# EAGLE design FeatherAzureSphereLongTall (EAGLE 8.0.2)
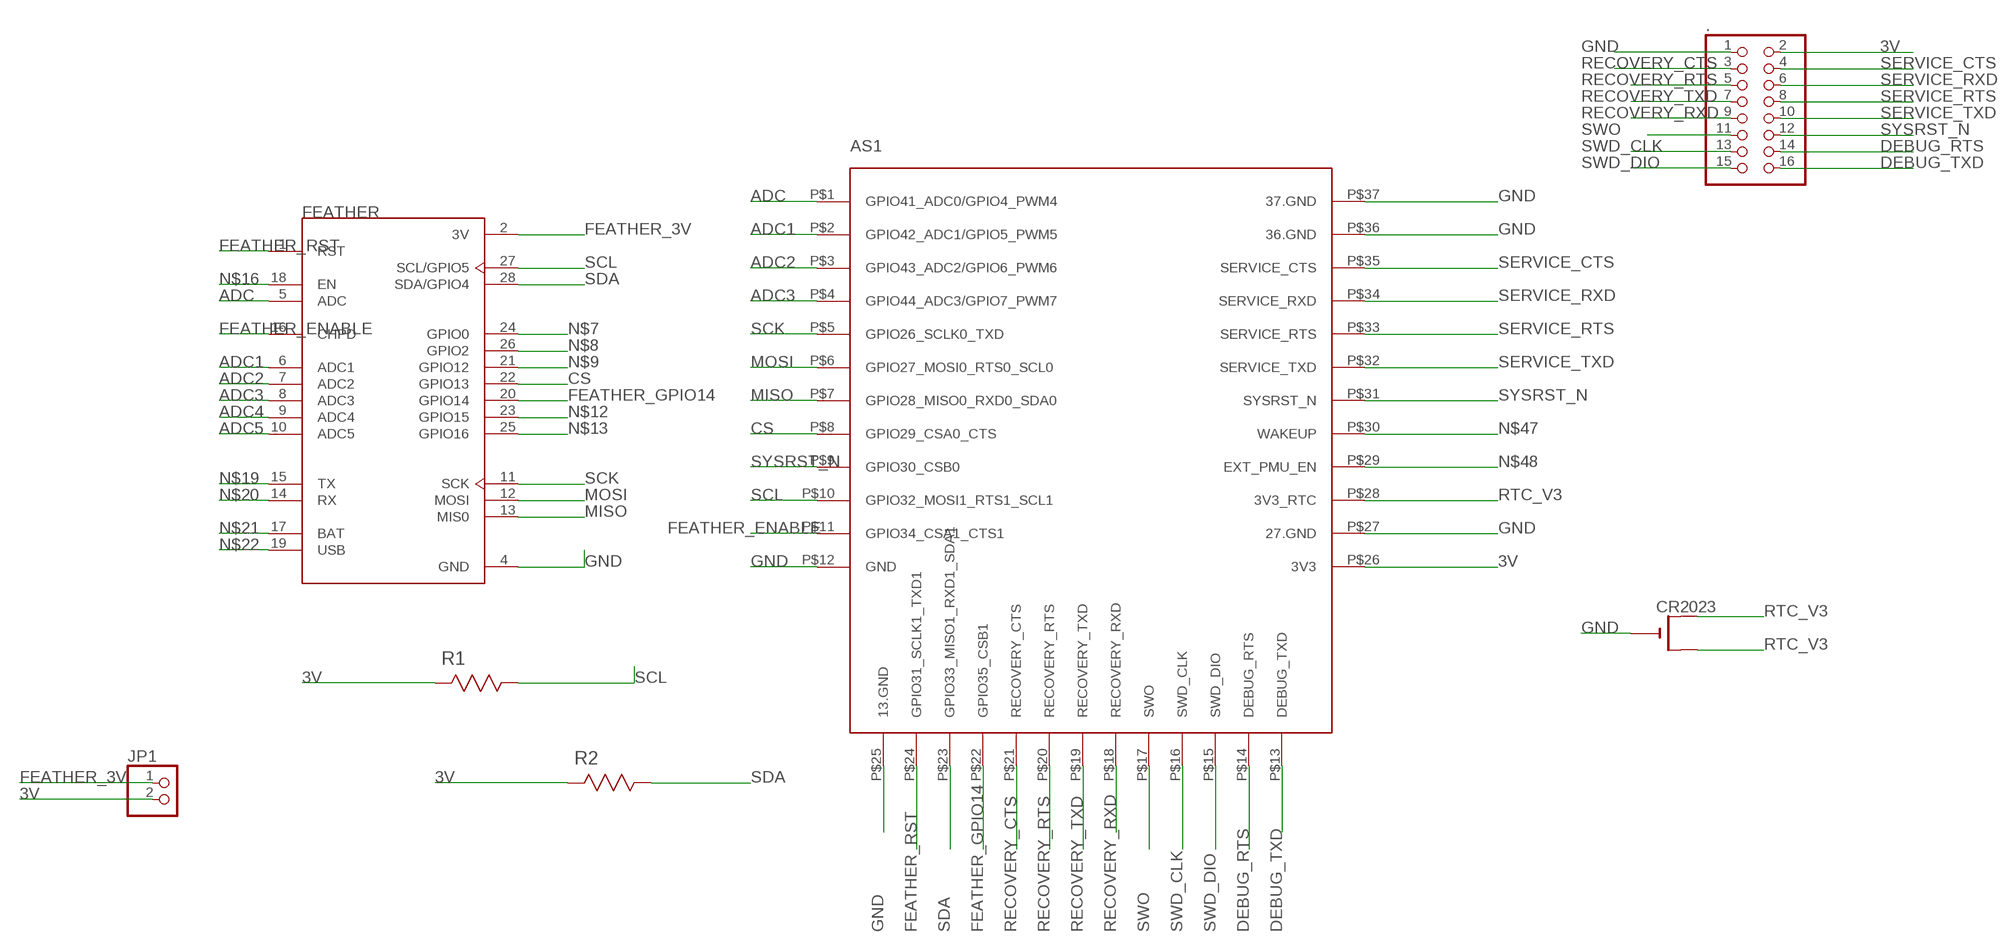
[diagram p0: schematic, sheet 1]

## Parts
.  PINHD-2X8  [2X08]
AS1  WF-M620-RSC1  [WF-M620-RSC1]
CR2023  CR2032SMT  [CR2032-SMD]
FEATHER  2821  [XCVR_2821]
JP1  PINHD-1X2  [1X02]
R1  ERJ-8RQF1R5V  [RESC3216X71N]
R2  ERJ-8RQF1R5V  [RESC3216X71N]

## Nets
3V: ..2 AS1.P$26(3V3) JP1.2 R1.2(R2) R2.2(R2)
ADC: AS1.P$1(GPIO41_ADC0/GPIO4_PWM4) FEATHER.5(ADC)
ADC1: AS1.P$2(GPIO42_ADC1/GPIO5_PWM5) FEATHER.6(ADC1)
ADC2: AS1.P$3(GPIO43_ADC2/GPIO6_PWM6) FEATHER.7(ADC2)
ADC3: AS1.P$4(GPIO44_ADC3/GPIO7_PWM7) FEATHER.8(ADC3)
ADC4: FEATHER.9(ADC4)
ADC5: FEATHER.10(ADC5)
CS: AS1.P$8(GPIO29_CSA0_CTS) FEATHER.22(GPIO13)
DEBUG_RTS: ..14 AS1.P$14(DEBUG_RTS)
DEBUG_TXD: ..16 AS1.P$13(DEBUG_TXD)
FEATHER_3V: FEATHER.2(3V) JP1.1
FEATHER_ENABLE: AS1.P$11(GPIO34_CSA1_CTS1) FEATHER.16(CHPD)
FEATHER_GPIO14: AS1.P$22(GPIO35_CSB1) FEATHER.20(GPIO14)
FEATHER_RST: AS1.P$24(GPIO31_SCLK1_TXD1) FEATHER.1(RST)
GND: ..1 AS1.P$12(GND) AS1.P$25(13.GND) AS1.P$27(27.GND) AS1.P$36(36.GND) AS1.P$37(37.GND) CR2023.- FEATHER.4(GND)
MISO: AS1.P$7(GPIO28_MISO0_RXD0_SDA0) FEATHER.13(MIS0)
MOSI: AS1.P$6(GPIO27_MOSI0_RTS0_SCL0) FEATHER.12(MOSI)
N$7: FEATHER.24(GPIO0)
N$8: FEATHER.26(GPIO2)
N$9: FEATHER.21(GPIO12)
N$12: FEATHER.23(GPIO15)
N$13: FEATHER.25(GPIO16)
N$16: FEATHER.18(EN)
N$19: FEATHER.15(TX)
N$20: FEATHER.14(RX)
N$21: FEATHER.17(BAT)
N$22: FEATHER.19(USB)
N$47: AS1.P$30(WAKEUP)
N$48: AS1.P$29(EXT_PMU_EN)
RECOVERY_CTS: ..3 AS1.P$21(RECOVERY_CTS)
RECOVERY_RTS: ..5 AS1.P$20(RECOVERY_RTS)
RECOVERY_RXD: ..9 AS1.P$18(RECOVERY_RXD)
RECOVERY_TXD: ..7 AS1.P$19(RECOVERY_TXD)
RTC_V3: AS1.P$28(3V3_RTC) CR2023.+$1(+) CR2023.+$2(+1)
SCK: AS1.P$5(GPIO26_SCLK0_TXD) FEATHER.11(SCK)
SCL: AS1.P$10(GPIO32_MOSI1_RTS1_SCL1) FEATHER.27(SCL/GPIO5) R1.1(R1)
SDA: AS1.P$23(GPIO33_MISO1_RXD1_SDA1) FEATHER.28(SDA/GPIO4) R2.1(R1)
SERVICE_CTS: ..4 AS1.P$35(SERVICE_CTS)
SERVICE_RTS: ..8 AS1.P$33(SERVICE_RTS)
SERVICE_RXD: ..6 AS1.P$34(SERVICE_RXD)
SERVICE_TXD: ..10 AS1.P$32(SERVICE_TXD)
SWD_CLK: ..13 AS1.P$16(SWD_CLK)
SWD_DIO: ..15 AS1.P$15(SWD_DIO)
SWO: ..11 AS1.P$17(SWO)
SYSRST_N: ..12 AS1.P$9(GPIO30_CSB0) AS1.P$31(SYSRST_N)

## Library data of the parts
. = pinhead:PINHD-2X8: PIN HEADER
AS1 = AzureSphere:WF-M620-RSC1
CR2023 = cr2032:CR2032
FEATHER = 2821:2821: Adafruit Feather HUZZAH with ESP8266 WiFi; AVAILABILITY: Unavailable; DESCRIPTION: Adafruit Feather HUZZAH with ESP8266 WiFi; MF: Adafruit Industries; MP: 2821; PACKAGE: None; PRICE: None
JP1 = pinhead:PINHD-1X2: PIN HEADER
R1 R2 = Panasonic_By_element14_Batch_1:ERJ-8RQF1R5V: RESISTOR, 1206; MPN: ERJ-8RQF1R5V; OC_FARNELL: 1717854; OC_NEWARK: 15R1531; SUPPLIER: Panasonic; TOLERANCE: ±1 %; VALUE: 1.5 Ohm; WATTAGE: 0.25 W

## Board
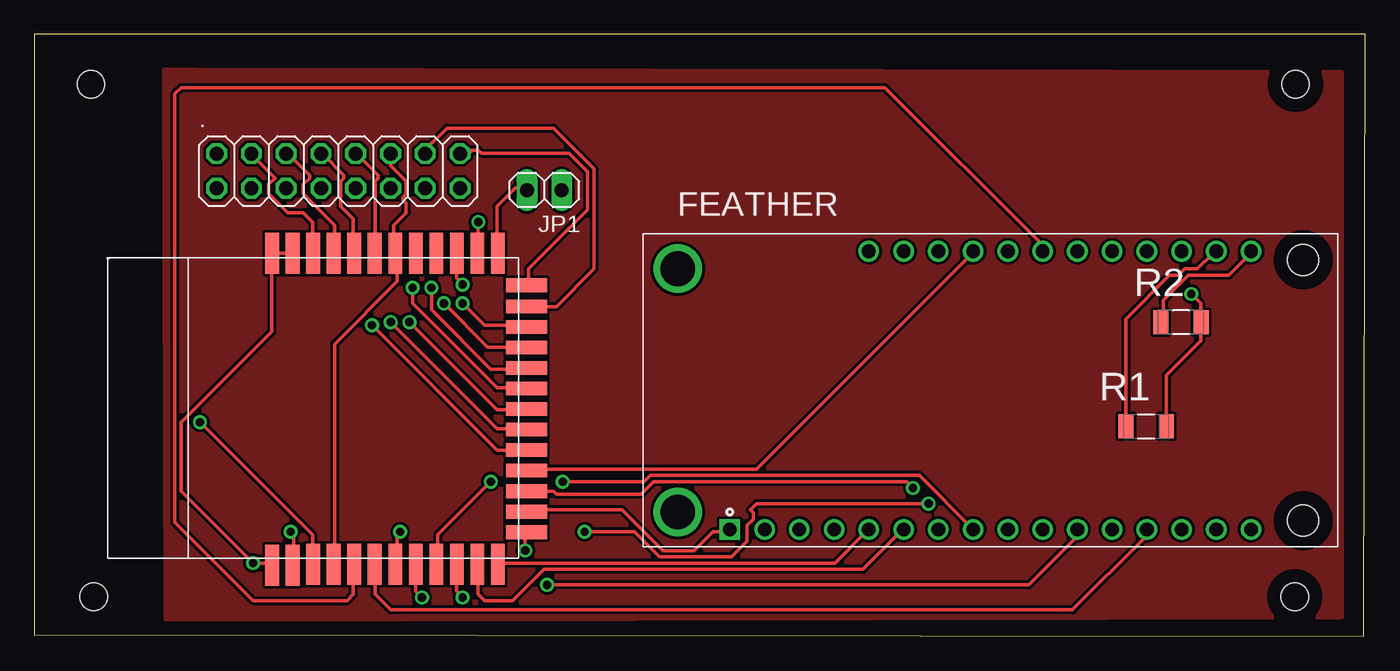
[diagram p1: board, top side]
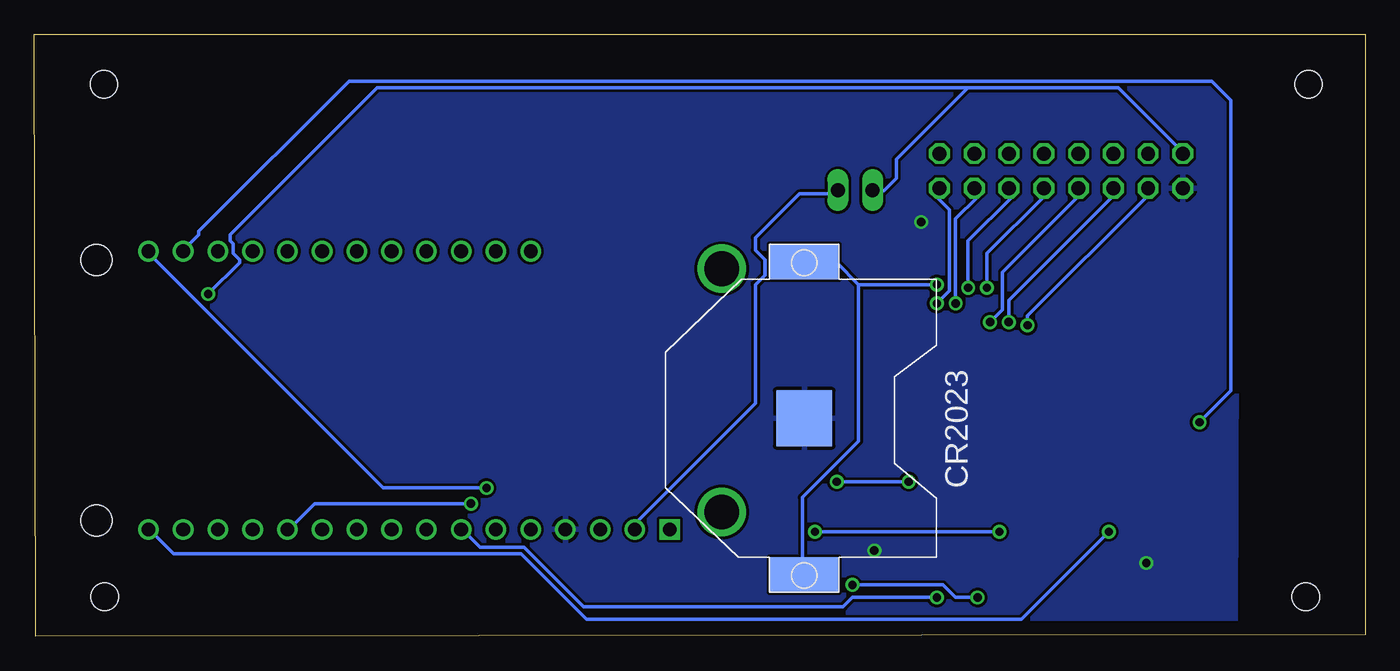
[diagram p2: board, bottom side, seen from below]

Size 97.3 x 44 mm. Coordinates in mm from the lower left corner, seen from the top.
Outline: 0,0.1 97.2,0 97.3,44 0,44 0,0.1
Copper layers (1*16): Top 0.035mm / dielectric 1.5mm / Bottom 0.035mm
Design rules "default": minimum track width 10mil, minimum drill 24mil, track to track 8mil, track to pad 8mil, pad to pad 8mil, via to via 8mil, smd to smd 8mil, copper to edge 40mil, drill to drill 8mil, minimum pad ring 10mil, minimum via ring 8mil, stop-mask expansion 4mil, vias tented up to drill 0mil, thermal gap 10mil
Holes 2 mm at 4.15,40.35 4.35,2.9 92.2,40.35 92.15,2.9

### Footprints (pad centres in the part's own frame; a part is rotated, then mirrored left to right if it is on the bottom)
2X08 = drill 1.016 octagon: 1 -8.89,-1.27; 2 -8.89,1.27; 3 -6.35,-1.27; 4 -6.35,1.27; 5 -3.81,-1.27; 6 -3.81,1.27; 7 -1.27,-1.27; 8 -1.27,1.27; 9 1.27,-1.27; 10 1.27,1.27; 11 3.81,-1.27; 12 3.81,1.27; 13 6.35,-1.27; 14 6.35,1.27; 15 8.89,-1.27; 16 8.89,1.27
WF-M620-RSC1 = smd 3 x 1: P$1 -11.95,-20.4; P$2 -11.95,-18.9; P$3 -11.95,-17.4; P$4 -11.95,-15.9; P$5 -11.95,-14.4; P$6 -11.95,-12.9; P$7 -11.95,-11.4; P$8 -11.95,-9.9; P$9 -11.95,-8.4; P$10 -11.95,-6.9; P$11 -12,-5.4; P$12 -12,-3.9; P$26 10.8,-20.4; P$27 10.8,-18.9; P$28 10.8,-17.4; P$29 10.8,-15.9; P$30 10.8,-14.4; P$31 10.8,-12.9; P$32 10.8,-11.4; P$33 10.8,-9.9; P$34 10.8,-8.4; P$35 10.8,-6.9; P$36 10.8,-5.4; P$37 10.8,-3.9 | smd 1 x 3: P$13 8.45,-22.5; P$14 6.9,-22.5; P$15 5.4,-22.5; P$16 3.9,-22.5; P$17 2.4,-22.5; P$18 0.9,-22.5; P$19 -0.6,-22.5; P$20 -2.1,-22.5; P$21 -3.6,-22.5; P$22 -5.1,-22.5; P$23 -6.6,-22.5; P$24 -8.1,-22.5; P$25 -9.6,-22.5
CR2032-SMD = smd 2.54 x 5.08: +$1 -11.43,0; +$2 11.43,0 | smd 4.064 x 4.064: - 0,0
XCVR_2821 = drill 1 square: 1 -19.05,-10.16 | drill 1: 2 -16.51,-10.16; 3 -13.97,-10.16; 4 -11.43,-10.16; 5 -8.89,-10.16; 6 -6.35,-10.16; 7 -3.81,-10.16; 8 -1.27,-10.16; 9 1.27,-10.16; 10 3.81,-10.16; 11 6.35,-10.16; 12 8.89,-10.16; 13 11.43,-10.16; 14 13.97,-10.16; 15 16.51,-10.16; 16 19.05,-10.16; 17 -8.89,10.16; 18 -6.35,10.16; 19 -3.81,10.16; 20 -1.27,10.16; 21 1.27,10.16; 22 3.81,10.16; 23 6.35,10.16; 24 8.89,10.16; 25 11.43,10.16; 26 13.97,10.16; 27 16.51,10.16; 28 19.05,10.16 | drill 2.54: S1 -22.86,-8.89; S2 -22.86,8.89 | hole 2.286: 22.86,-9.525; 22.86,9.525
1X02 = drill 1.016 long: 1 -1.27,0; 2 1.27,0
RESC3216X71N = smd 1.118 x 1.753: 1 -1.473,0; 2 1.473,0

### Placement (x,y rotation side)
.  22.23,34.01 0 top
AS1  13.49,17.21 90 top
CR2023  41.01,15.94 270 bottom
FEATHER  69.9,17.98 0 top
JP1  37.29,32.61 180 top
R1  81.28,15.34 0 top
R2  83.82,22.96 0 top

### Tracks (layer width: path | path; a pad name or v marks a point on that pad's centre or on a via)
3V  (via drill 0.61)
  Top 0.254: R1.2 82.75,19.07 85.27,21.59 85.27,22.96 | AS1.P$26 33.83,28.22 33.83,31.42 35.2,32.79 35.89,32.79 JP1.2 | 85.27,22.96 85.27,24.33 v84.58,25.02 | 85.27,22.96 R2.2
  Bottom 0.254: 29.03,40.11 18.06,40.11 13.49,35.53 13.49,35.3 ..2 | 29.03,40.11 34.29,34.85 34.29,33.48 35.2,32.56 35.89,32.56 JP1.2 | v84.58,25.02 82.3,27.3 82.3,27.53 82.75,27.99 82.75,28.68 82.98,28.9 82.98,29.36 72.24,40.11 29.03,40.11
ADC
  Top 0.254: AS1.P$1 34.06,5.36 58.52,5.36 60.81,7.64 FEATHER.5
ADC1
  Top 0.254: AS1.P$2 32.46,5.13 32.46,3.07 32.92,2.62 34.98,2.62 37.26,4.9 60.58,4.9 63.32,7.64 FEATHER.6
ADC2  (via drill 0.61)
  Top 0.254: v31.32,2.84 30.86,3.3 30.86,5.13 AS1.P$3
  Bottom 0.254: v31.32,2.84 37.49,2.84 38.18,2.16 57.15,2.16 61.49,6.5 64.69,6.5 66.06,7.87 FEATHER.7
ADC3  (via drill 0.61)
  Top 0.254: v33.38,11.3 29.49,7.42 29.49,5.36 AS1.P$4 | v38.63,11.3 44.58,11.3 45.03,11.76 64.69,11.76 68.58,7.87 FEATHER.8
  Bottom 0.254: v38.63,11.3 v33.38,11.3
CS
  Top 0.254: AS1.P$8 23.32,5.13 23.32,3.07 22.86,2.62 16,2.62 10.29,8.33 10.29,39.65 10.74,40.11 62.18,40.11 73.61,28.68 73.61,28.22 FEATHER.22
DEBUG_RTS
  Top 0.254: AS1.P$14 36.12,24.1 38.18,24.1 40.92,26.85 40.92,34.16 37.95,37.13 30.18,37.13 28.8,35.76 28.8,35.3 ..14
DEBUG_TXD
  Top 0.254: AS1.P$13 36.12,25.7 36.12,26.85 40.46,31.19 40.46,33.93 39.09,35.3 32.69,35.3 32.46,35.53 32,35.53 31.77,35.3 31.32,35.3 ..16
FEATHER_3V
  Bottom 0.254: FEATHER.2 53.26,7.87 53.26,8.33 44.58,17.02 44.58,25.7 43.89,26.39 43.89,27.53 44.58,28.22 44.58,29.13 41.38,32.33 38.86,32.33 38.63,32.56 JP1.1
FEATHER_ENABLE  (via drill 0.61)
  Top 0.254: v18.75,7.64 18.97,7.42 18.97,5.36 AS1.P$11
  Bottom 0.254: v18.75,7.64 25.15,1.24 56.92,1.24 61.72,6.04 87.1,6.04 88.92,7.87 FEATHER.16
FEATHER_GPIO14
  Top 0.254: AS1.P$22 36.12,12.22 52.81,12.22 68.58,27.99 FEATHER.20
FEATHER_RST
  Top 0.254: AS1.P$24 36.12,9.24 42.98,9.24 45.95,6.27 48.23,6.27 49.61,7.64 50.75,7.64 FEATHER.1
GND  (via drill 0.61)
  Top 0.254: AS1.P$12 17.37,5.36 v16,5.36 10.74,10.62 10.74,15.64 17.37,22.27 17.37,27.99 AS1.P$37 17.6,27.99 18.75,27.99 AS1.P$36 | v35.89,6.27 35.89,7.42 AS1.P$25 | v32.46,30.28 32.46,28.22 AS1.P$27
  pour Bottom: 98.25,41.4 98,1.1 9.5,0.7 9.35,41.2 9.6,41.45
MISO
  Top 0.254: AS1.P$7 24.92,5.13 24.92,3.07 26.06,1.93 75.89,1.93 81.15,7.19 81.15,7.64 FEATHER.13
MOSI  (via drill 0.61)
  Top 0.254: v26.75,7.64 26.52,7.42 26.52,5.36 AS1.P$6 | v40.23,7.64 43.89,7.64 45.72,5.81 50.98,5.81 52.12,6.96 52.12,8.1 52.58,8.56 52.58,9.01 52.35,9.24 52.81,9.7 v65.38,9.7
  Bottom 0.254: v40.23,7.64 v26.75,7.64 | v65.38,9.7 76.81,9.7 78.64,7.87 FEATHER.12
N$1
  pour Top: 95.55,41.2 95.55,1.45 9.65,1.25 9.55,41.35 11.8,41.35
RECOVERY_CTS  (via drill 0.61)
  Top 0.254: v24.69,22.73 33.83,13.59 35.89,13.59 AS1.P$21
  Bottom 0.254: v24.69,22.73 24.69,23.42 16,32.1 16,32.56 ..3
RECOVERY_RTS  (via drill 0.61)
  Top 0.254: v26.06,22.96 33.83,15.19 35.89,15.19 AS1.P$20
  Bottom 0.254: v26.06,22.96 26.06,24.56 18.52,32.1 18.52,32.56 ..5
RECOVERY_RXD  (via drill 0.61)
  Top 0.254: v27.66,25.48 27.66,24.33 33.83,18.16 35.89,18.16 AS1.P$18
  Bottom 0.254: v27.66,25.48 27.66,27.99 23.55,32.1 23.55,32.56 ..9
RECOVERY_TXD  (via drill 0.61)
  Top 0.254: v27.43,22.96 33.83,16.56 35.89,16.56 AS1.P$19
  Bottom 0.254: v27.43,22.96 26.52,23.87 26.52,26.62 21.03,32.1 21.03,32.56 ..7
RTC_V3  (via drill 0.61)
  Top 0.254: v31.32,25.7 30.86,26.16 30.86,27.99 AS1.P$28
  Bottom 0.254: 37.03,25.7 v31.32,25.7 | 37.03,25.7 38.63,27.3 40.92,27.3 CR2023.+$1 | 37.03,25.7 37.03,14.27 41.15,10.16 41.15,4.67 CR2023.+$2
SCK  (via drill 0.61)
  Top 0.254: v28.35,2.84 27.89,3.3 27.89,5.13 AS1.P$5 | v37.49,3.76 72.69,3.76 76.12,7.19 76.12,7.64 FEATHER.11
  Bottom 0.254: v28.35,2.84 29.95,2.84 30.86,3.76 v37.49,3.76
SCL  (via drill 0.61)
  Top 0.254: R1.1 79.78,15.42 79.78,23.19 82.98,26.39 83.67,26.39 84.12,26.85 85.04,26.85 86.18,27.99 FEATHER.27 | v12.12,15.64 20.34,7.42 20.34,5.36 AS1.P$10
  Bottom 0.254: v12.12,15.64 9.83,17.93 9.83,39.19 11.2,40.56 74.3,40.56 85.27,29.59 85.27,29.36 86.41,28.22 FEATHER.27
SDA  (via drill 0.61)
  Top 0.254: R2.1 82.53,22.96 82.53,24.56 84.35,26.39 87.33,26.39 88.92,27.99 FEATHER.28 | v64.24,10.84 63.78,11.3 45.26,11.3 44.35,10.39 38.18,10.39 37.95,10.62 36.12,10.62 AS1.P$23
  Bottom 0.254: v64.24,10.84 71.78,10.84 88.92,27.99 FEATHER.28
SERVICE_CTS
  Top 0.254: AS1.P$35 20.34,28.22 20.34,30.28 19.66,30.96 18.52,30.96 17.14,32.33 17.14,33.02 17.6,33.48 16,35.08 ..4
SERVICE_RTS
  Top 0.254: AS1.P$33 23.32,28.22 23.32,30.5 22.4,31.42 22.4,33.25 22.63,33.48 22.63,33.7 21.03,35.3 ..8
SERVICE_RXD
  Top 0.254: AS1.P$34 21.95,28.22 21.95,30.05 19.66,32.33 19.66,33.02 20.12,33.48 20.12,33.7 18.52,35.3 ..6
SERVICE_TXD
  Top 0.254: AS1.P$32 24.92,28.22 24.92,33.25 25.15,33.48 25.15,33.7 23.55,35.3 ..10
SWD_CLK  (via drill 0.61)
  Top 0.254: v29.95,24.33 33.15,21.13 35.89,21.13 AS1.P$16
  Bottom 0.254: v29.95,24.33 29.95,30.5 28.35,32.1 28.35,32.33 28.57,32.56 ..13
SWD_DIO  (via drill 0.61)
  Top 0.254: v31.32,24.33 32.92,22.73 35.89,22.73 AS1.P$15
  Bottom 0.254: v31.32,24.33 30.4,25.25 30.4,31.19 31.32,32.1 31.32,32.56 ..15
SWO  (via drill 0.61)
  Top 0.254: v29.03,25.48 29.03,23.87 33.38,19.53 35.89,19.53 AS1.P$17
  Bottom 0.254: v29.03,25.48 29.03,28.9 25.83,32.1 25.83,32.56 ..11
SYSRST_N
  Top 0.254: AS1.P$9 21.95,5.36 21.95,21.36 26.52,25.93 26.52,27.99 AS1.P$31 26.29,28.22 26.29,30.05 27.2,30.96 27.2,31.65 26.98,31.88 26.98,32.1 27.2,32.33 27.2,33.25 26.06,34.39 26.06,35.08 ..12